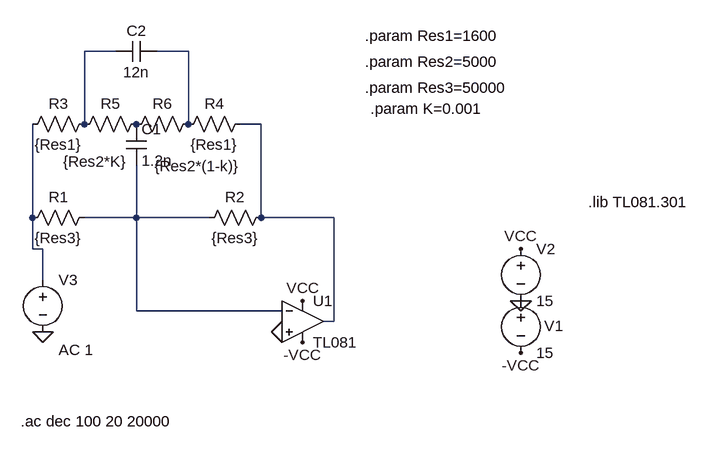
[diagram p0: schematic 1etapa.asc]
1etapa.asc, the LTspice schematic file:
Version 4
SHEET 1 880 680
WIRE -160 -256 -208 -256
WIRE -48 -256 -96 -256
WIRE -208 -144 -208 -256
WIRE -48 -144 -48 -256
WIRE 64 -144 32 -144
WIRE -288 0 -288 -144
WIRE -128 0 -128 -80
WIRE -128 0 -208 0
WIRE -16 0 -128 0
WIRE 64 0 64 -144
WIRE 176 0 64 0
WIRE -288 48 -288 0
WIRE -272 48 -288 48
WIRE -272 96 -272 48
WIRE -128 144 -128 0
WIRE 96 144 -128 144
WIRE 176 160 176 0
WIRE 176 160 160 160
FLAG 128 128 VCC
FLAG 464 48 VCC
FLAG 128 192 -VCC
FLAG 464 208 -VCC
FLAG 464 128 0
FLAG 96 176 0
FLAG -272 176 0
SYMBOL Opamps\\opamp2 128 96 R0
SYMATTR InstName U1
SYMATTR Value TL081
SYMBOL voltage 464 112 R0
WINDOW 0 36 55 Left 2
WINDOW 123 0 0 Left 2
WINDOW 39 0 0 Left 2
SYMATTR InstName V1
SYMATTR Value 15
SYMBOL voltage 464 32 R0
WINDOW 123 0 0 Left 2
WINDOW 39 0 0 Left 2
SYMATTR InstName V2
SYMATTR Value 15
SYMBOL res -192 -16 R90
WINDOW 0 0 56 VBottom 2
WINDOW 3 32 56 VTop 2
SYMATTR InstName R1
SYMATTR Value {Res3}
SYMBOL res 80 -16 R90
WINDOW 0 0 56 VBottom 2
WINDOW 3 32 56 VTop 2
SYMATTR InstName R2
SYMATTR Value {Res3}
SYMBOL res -192 -160 R90
WINDOW 0 0 56 VBottom 2
WINDOW 3 32 56 VTop 2
SYMATTR InstName R3
SYMATTR Value {Res1}
SYMBOL res 48 -160 R90
WINDOW 0 0 56 VBottom 2
WINDOW 3 32 56 VTop 2
SYMATTR InstName R4
SYMATTR Value {Res1}
SYMBOL res -112 -160 R90
WINDOW 0 0 56 VBottom 2
WINDOW 3 58 80 VTop 2
SYMATTR InstName R5
SYMATTR Value {Res2*K}
SYMBOL res -32 -160 R90
WINDOW 0 0 56 VBottom 2
WINDOW 3 65 2 VTop 2
SYMATTR InstName R6
SYMATTR Value {Res2*(1-k)}
SYMBOL cap -144 -144 R0
SYMATTR InstName C1
SYMATTR Value 1.2n
SYMBOL cap -96 -272 R90
WINDOW 0 0 32 VBottom 2
WINDOW 3 32 32 VTop 2
SYMATTR InstName C2
SYMATTR Value 12n
SYMBOL voltage -272 80 R0
WINDOW 123 24 124 Left 2
WINDOW 39 0 0 Left 2
SYMATTR InstName V3
SYMATTR Value ""
SYMATTR Value2 AC 1
TEXT 568 -24 Left 2 !.lib TL081.301
TEXT 224 -280 Left 2 !.param Res1=1600
TEXT 224 -240 Left 2 !.param Res2=5000
TEXT 224 -200 Left 2 !.param Res3=50000
TEXT 232 -168 Left 2 !.param K=0.001
TEXT -306 314 Left 2 !.ac dec 100 20 20000

The netlist it stands for:
* 1etapa.asc
XU1 0 N005 VCC -VCC N003 TL081  ; pins In+ In- V+ V- OUT
V1 0 -VCC 15
V2 VCC 0 15
R1 N005 N004 {Res3}
R2 N003 N005 {Res3}
R3 N001 N004 {Res1}
R4 N003 N002 {Res1}
R5 P001 N001 {Res2*K}
R6 N002 P001 {Res2*(1-k)}
C1 P001 N005 1.2n
C2 N002 N001 12n
V3 N004 0 AC 1
.lib TL081.301
.param Res1=1600
.param Res2=5000
.param Res3=50000
.param K=0.001
.ac dec 100 20 20000
.backanno
.end